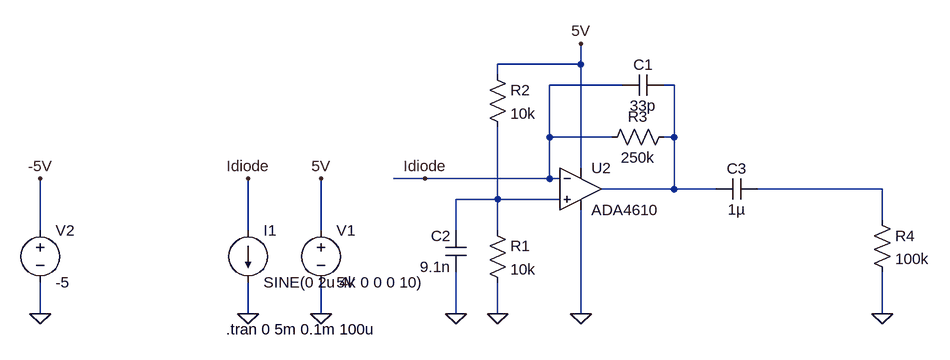
[diagram p0: schematic Receiver.asc]
Receiver.asc, the LTspice schematic file:
Version 4
SHEET 1 976 680
WIRE 432 -48 432 -80
WIRE 432 -48 304 -48
WIRE 304 -32 304 -48
WIRE 496 -16 384 -16
WIRE 576 -16 560 -16
WIRE 384 64 384 -16
WIRE 480 64 384 64
WIRE 576 64 576 -16
WIRE 576 64 560 64
WIRE 432 112 432 -48
WIRE 192 128 144 128
WIRE 384 128 384 64
WIRE 384 128 192 128
WIRE 400 128 384 128
WIRE 576 144 576 64
WIRE 576 144 464 144
WIRE 640 144 576 144
WIRE 896 144 704 144
WIRE 304 160 304 48
WIRE 304 160 240 160
WIRE 400 160 304 160
WIRE 896 192 896 144
WIRE -400 208 -400 128
WIRE -80 208 -80 128
WIRE 32 208 32 128
WIRE 240 208 240 160
WIRE 304 208 304 160
WIRE -400 336 -400 288
WIRE -80 336 -80 288
WIRE 32 336 32 288
WIRE 240 336 240 272
WIRE 304 336 304 288
WIRE 432 336 432 176
WIRE 896 336 896 272
FLAG 432 336 0
FLAG -80 336 0
FLAG -80 128 Idiode
FLAG 32 336 0
FLAG 32 128 5V
FLAG 432 -80 5V
FLAG 304 336 0
FLAG 240 336 0
FLAG 192 128 Idiode
FLAG -400 336 0
FLAG -400 128 -5V
FLAG 896 336 0
SYMBOL voltage 32 192 R0
WINDOW 123 0 0 Left 0
WINDOW 39 0 0 Left 0
SYMATTR InstName V1
SYMATTR Value 5V
SYMBOL res 288 192 R0
SYMATTR InstName R1
SYMATTR Value 10k
SYMBOL res 288 -48 R0
SYMATTR InstName R2
SYMATTR Value 10k
SYMBOL res 576 48 R90
WINDOW 0 0 56 VBottom 2
WINDOW 3 32 56 VTop 2
SYMATTR InstName R3
SYMATTR Value 250k
SYMBOL cap 560 -32 R90
WINDOW 0 0 32 VBottom 2
WINDOW 3 32 32 VTop 2
SYMATTR InstName C1
SYMATTR Value 33p
SYMBOL cap 256 272 R180
WINDOW 0 24 56 Left 2
WINDOW 3 24 8 Left 2
SYMATTR InstName C2
SYMATTR Value 9.1n
SYMBOL current -80 208 R0
WINDOW 123 0 0 Left 0
WINDOW 39 0 0 Left 0
SYMATTR InstName I1
SYMATTR Value SINE(0 2u 4k 0 0 0 10)
SYMBOL OpAmps\\ADA4610 432 80 R0
SYMATTR InstName U2
SYMBOL voltage -400 192 R0
WINDOW 123 0 0 Left 0
WINDOW 39 0 0 Left 0
SYMATTR InstName V2
SYMATTR Value -5
SYMBOL cap 704 128 R90
WINDOW 0 0 32 VBottom 2
WINDOW 3 32 32 VTop 2
SYMATTR InstName C3
SYMATTR Value 1µ
SYMBOL res 880 176 R0
SYMATTR InstName R4
SYMATTR Value 100k
TEXT -114 360 Left 2 !.tran 0 5m 0.1m 100u

The netlist it stands for:
* Receiver.asc
V1 5V 0 5V
R1 N003 0 10k
R2 5V N003 10k
R3 N001 Idiode 250k
C1 N001 Idiode 33p
C2 0 N003 9.1n
I1 Idiode 0 SINE(0 2u 4k 0 0 0 10)
XU2 N003 Idiode 5V 0 N001 ADA4610  ; pins In+ In- V+ V- OUT
V2 -5V 0 -5
C3 N002 N001 1µ
R4 N002 0 100k
.tran 0 5m 0.1m 100u
.backanno
.end